# EAGLE board MotorControl_M4 (EAGLE 9.6.2), part 1 of 2
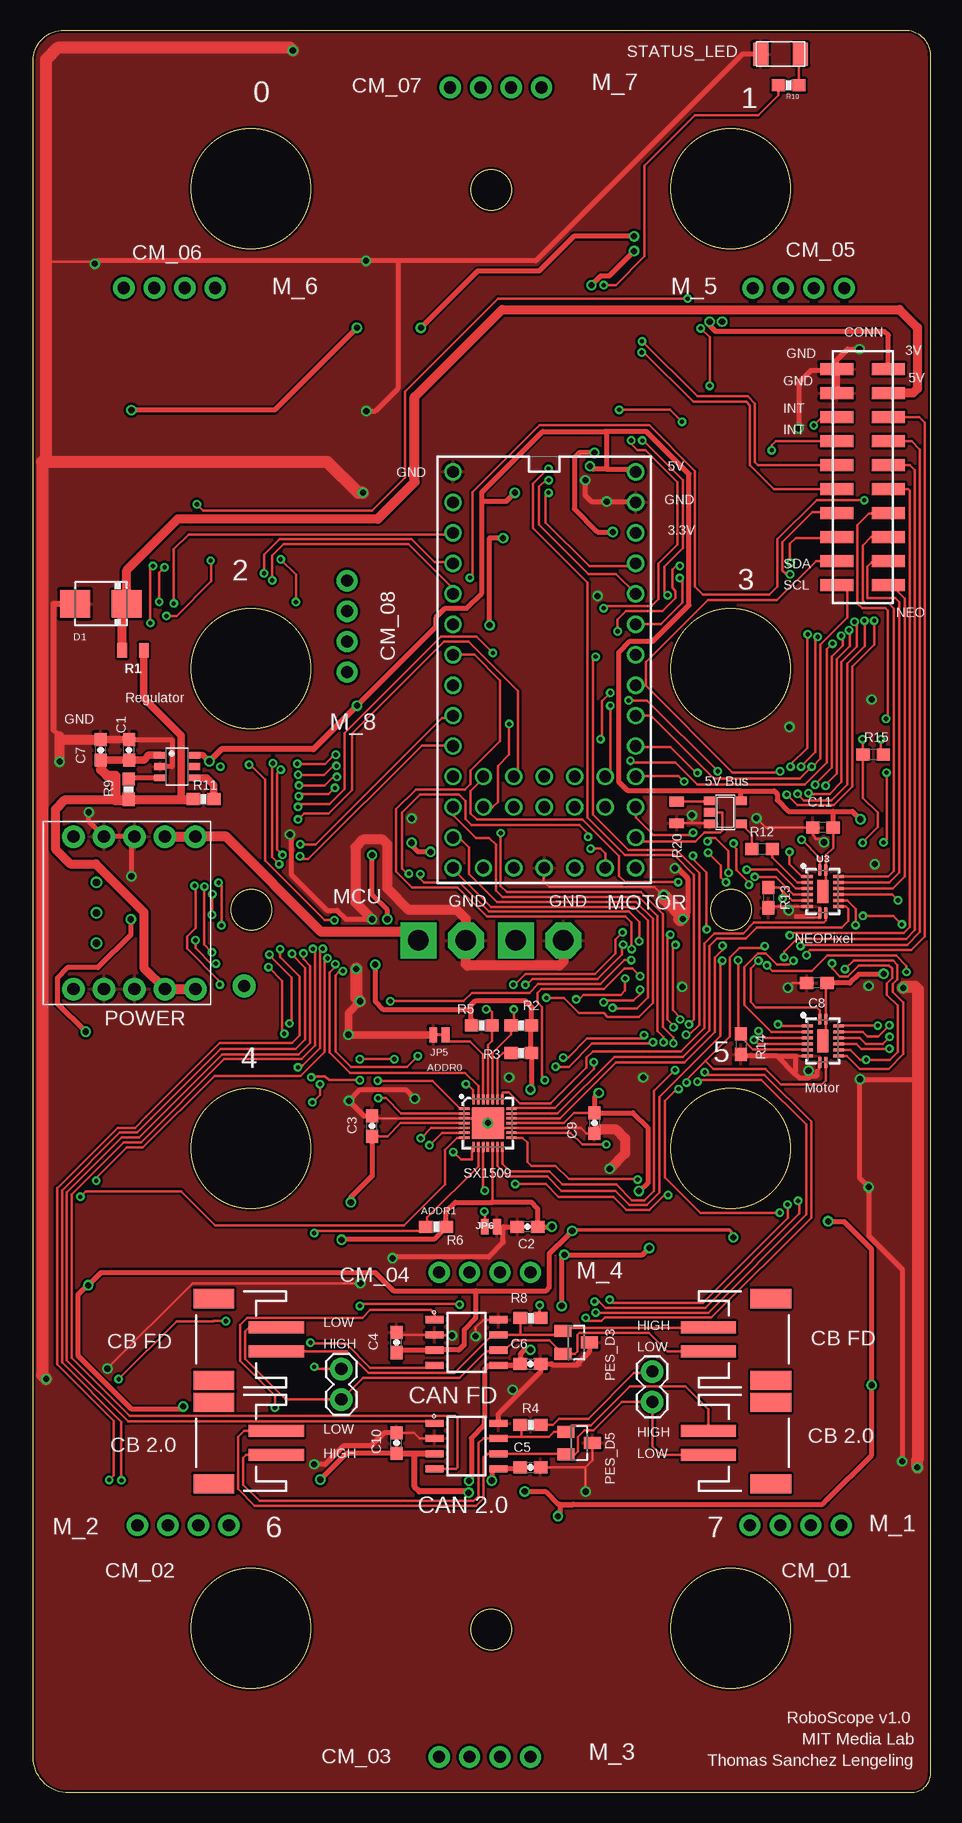
[diagram p5: board, top side]
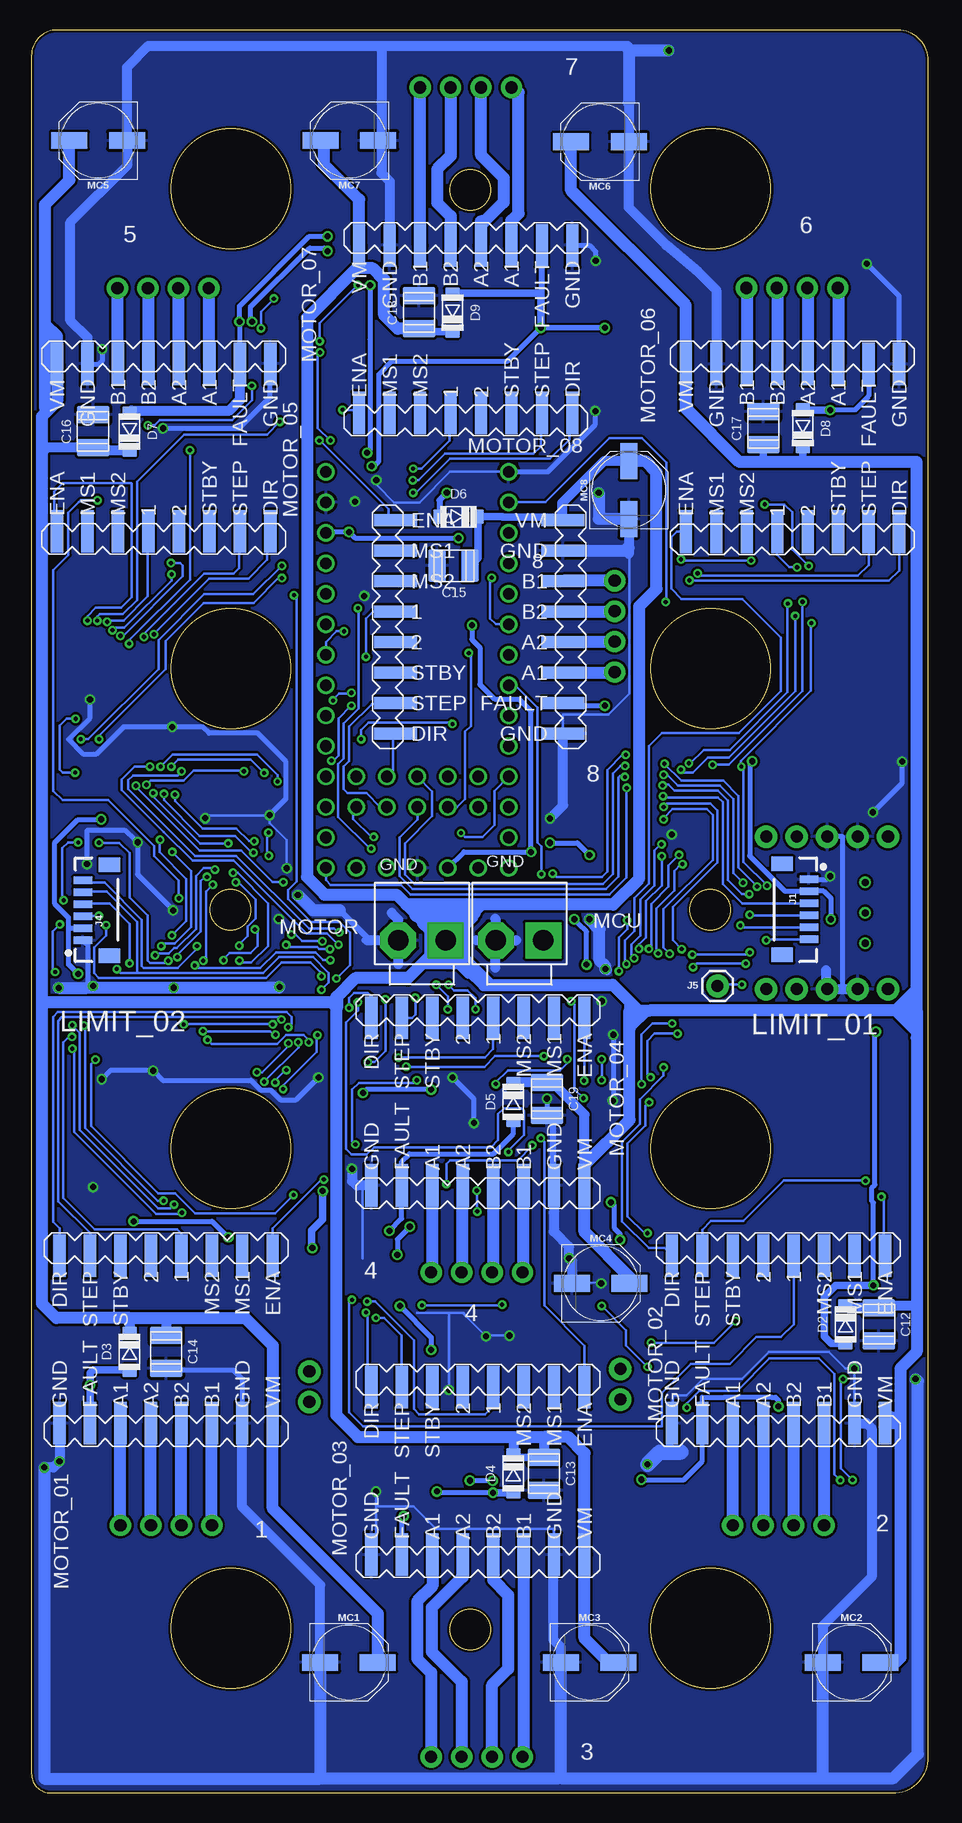
[diagram p6: board, bottom side, seen from below]

Size 74.79 x 146.95 mm. Coordinates in mm from the lower left corner, seen from the top.
Outline: 0,2.98 0,144.39 arc-90 2.56,146.95 72.66,146.95 arc-90 74.79,144.82 74.79,1.6 arc-90 73.19,0 2.98,0 arc-90 0,2.98
Outline: circle at 18.2,73.62 radius 1.7
Outline: circle at 38.2,133.62 radius 1.7
Outline: circle at 38.2,13.62 radius 1.7
Outline: circle at 58.2,73.62 radius 1.7
Outline: circle at 58.16,133.71 radius 5
Outline: circle at 58.16,93.71 radius 5
Outline: circle at 58.16,53.71 radius 5
Outline: circle at 58.16,13.71 radius 5
Outline: circle at 18.16,13.71 radius 5
Outline: circle at 18.16,53.71 radius 5
Outline: circle at 18.16,93.71 radius 5
Outline: circle at 18.16,133.71 radius 5
Copper layers (1+2*15+16): Top 0.035559375mm / dielectric 0.47751875mm / VCC 0.035559375mm / dielectric 0.47751875mm / GND 0.035559375mm / dielectric 0.47751875mm / Bottom 0.035559375mm
Design rules "SparkFun-4-Layer-General-JLCPCB": minimum track width 7mil, minimum drill 12mil, track to track 7mil, track to pad 7mil, pad to pad 7mil, via to via 7mil, smd to smd 7mil, copper to edge 7mil, drill to drill 7mil, minimum pad ring 7mil, minimum via ring 7mil, stop-mask expansion 3mil, vias tented up to drill 25mil, thermal gap 10mil
Net classes: 0 default: drill 0.35 mm, clearance 0.2 mm; 1 gnd: width 0.2 mm, drill 0.508 mm, clearance 0.2 mm; 3 vcc: width 0.2 mm, drill 0.508 mm, clearance 0.2 mm; 4 vcc5: width 0.55 mm, drill 0.508 mm, clearance 0.2 mm

## Footprints (pad centres in the part's own frame; a part is rotated, then mirrored left to right if it is on the bottom)
0603-CAP = smd 1.1 x 1: 1 -0.85,0; 2 0.85,0
0603 = smd 1.1 x 1: 1 -0.85,0; 2 0.85,0
C1210 = smd 2.7 x 1.45: 1 0,1.4; 2 0,-1.35
JST-2-SMD = smd 1 x 4.6: 1 -1,-3.7; 2 1,-3.7 | smd 1.6 x 3.4: NC1 -3.4,1.5; NC2 3.4,1.5
1X04-CLEANBIG = drill 1.016 pad 1.778: 1 -3.81,0; 2 -1.27,0; 3 1.27,0; 4 3.81,0
DO214AA = smd 2.5 x 2.3: A 2.15,0; C -2.15,0
SOD123 = smd 1.2 x 1: A 0,-1.6; C 0,1.6
SOT23-5 = smd 0.69 x 0.99: 1 -0.95,-1.29; 2 0,-1.29; 3 0.95,-1.29; 4 0.95,1.3; 5 -0.95,1.3
1X06-1MM = smd 0.6 x 1.55: 1 -2.54,1.27; 2 -1.54,1.27; 3 -0.54,1.27; 4 0.46,1.27; 5 1.46,1.27; 6 2.46,1.27 | smd 1.2 x 1.8: P$1 -3.84,-0.955; P$2 3.76,-0.955
1X02 = drill 1.016 pad 1.88: 1 0,0; 2 2.54,0
1X01 = drill 1.016 pad 1.88: 1 0,0
SMT-JUMPER_2_NC_TRACE_NO-SILK = smd 0.635 x 1.27: 1 -0.508,0; 2 0.508,0
PANASONIC_D = smd 3 x 1.4: + 2.4,0; - -2.4,0
SOIC127P600X175-8N = smd 1.5 x 0.6: 1 -2.65,1.905; 2 -2.65,0.635; 3 -2.65,-0.635; 4 -2.65,-1.905; 5 2.65,-1.905; 6 2.65,-0.635; 7 2.65,0.635; 8 2.65,1.905
DRV8880 = smd 3.556 x 1.016: 1 -6.985,1.27; 2 -6.985,-1.27; A1 6.985,-3.81; A2 6.985,-1.27; B1 6.985,3.81; B2 6.985,1.27; DIR -6.985,-8.89; ENA -6.985,8.89; FAULT 6.985,-6.35; GND_0 6.985,-8.89; GND_1 6.985,6.35; MS1 -6.985,6.35; MS2 -6.985,3.81; STBY -6.985,-3.81; STEP -6.985,-6.35; VM 6.985,8.89
87759-20 = smd 1 x 2.75: 1 -9,-2.15; 2 -9,2.15; 3 -7,-2.15; 4 -7,2.15; 5 -5,-2.15; 6 -5,2.15; 7 -3,-2.15; 8 -3,2.15; 9 -1,-2.15; 10 -1,2.15; 11 1,-2.15; 12 1,2.15; 13 3,-2.15; 14 3,2.15; 15 5,-2.15; 16 5,2.15; 17 7,-2.15; 18 7,2.15; 19 9,-2.15; 20 9,2.15
SOT23 = smd 1 x 1.4: 1 -0.95,-1.1; 2 0.95,-1.1; 3 0,1.1
B2P-VH = drill 1.7 pad 3 square: 1 -1.98,0 | drill 1.7 pad 3 octagon: 2 1.98,0
0805 = smd 0.8 x 1.2: 1 -0.9,0; 2 0.9,0
0603-RES = smd 1.1 x 1: 1 -0.85,0; 2 0.85,0
LED1206FAB = smd 1.27 x 1.905: 1 -1.651,0; 2 1.651,0
QFN-28 = smd 0.85 x 0.2: 1 -1.975,1.2; 2 -1.975,0.8; 3 -1.975,0.4; 4 -1.975,0; 5 -1.975,-0.4; 6 -1.975,-0.8; 7 -1.975,-1.2; 15 1.975,-1.2; 16 1.975,-0.8; 17 1.975,-0.4; 18 1.975,0; 19 1.975,0.4; 20 1.975,0.8; 21 1.975,1.2 | smd 0.2 x 0.85: 8 -1.2,-1.975; 9 -0.8,-1.975; 10 -0.4,-1.975; 11 0,-1.975; 12 0.4,-1.975; 13 0.8,-1.975; 14 1.2,-1.975; 22 1.2,1.975; 23 0.8,1.975; 24 0.4,1.975; 25 0,1.975; 26 -0.4,1.975; 27 -0.8,1.975; 28 -1.2,1.975 | smd 2.65 x 2.65: 29 0,0
SOT23-6 = smd 1 x 0.55: 1 -1.4,0.95; 2 -1.4,0; 3 -1.4,-0.95; 4 1.4,-0.95; 5 1.4,0; 6 1.4,0.95
DHVQFN-16-2.5X3.5MM = smd 0.9 x 0.24: 1 -1.8,-0.25; 8 1.8,-0.25; 9 1.8,0.25; 16 -1.8,0.25 | smd 0.24 x 0.9: 2 -1.25,-1.3; 3 -0.75,-1.3; 4 -0.25,-1.3; 5 0.25,-1.3; 6 0.75,-1.3; 7 1.25,-1.3; 10 1.25,1.3; 11 0.75,1.3; 12 0.25,1.3; 13 -0.25,1.3; 14 -0.75,1.3; 15 -1.25,1.3 | smd 1.9 x 0.9: EP 0,0
MOSFET_SLIDER = drill 1.016 pad 1.88: GND_1 1.27,8.89; GND_2 1.27,6.35; GND_3 13.97,8.89; GND_4 13.97,6.35; GND_5 13.97,3.81; ON 1.27,3.81; VIN_1 1.27,13.97; VIN_2 1.27,11.43; VOUT_1 13.97,13.97; VOUT_2 13.97,11.43 | drill 0.6: P$13 5.08,5.715; P$14 7.62,5.715; P$15 10.16,5.715
TEENSY_4.0_WITH_SMD_HEADER_PINS = drill 0.965: 0 -7.62,13.97; 1 -7.62,11.43; 2 -7.62,8.89; 3 -7.62,6.35; 3.3V 7.62,11.43; 3.3V1 -2.54,-16.51; 4 -7.62,3.81; 5 -7.62,1.27; 6 -7.62,-1.27; 7 -7.62,-3.81; 8 -7.62,-6.35; 9 -7.62,-8.89; 10 -7.62,-11.43; 11 -7.62,-13.97; 12 -7.62,-16.51; 13 7.62,-16.51; 14/A0 7.62,-13.97; 15/A1 7.62,-11.43; 16/A2 7.62,-8.89; 17/A3 7.62,-6.35; 18/A4 7.62,-3.81; 19/A5 7.62,-1.27; 20/A6 7.62,1.27; 21/A7 7.62,3.81; 22/A8 7.62,6.35; 23/A9 7.62,8.89; 24 5.08,-11.43; 25 5.08,-8.89; 26 2.54,-11.43; 27 2.54,-8.89; 28 0,-11.43; 29 0,-8.89; 30 -2.54,-11.43; 31 -2.54,-8.89; 32 -5.08,-11.43; 33 -5.08,-8.89; GND -7.62,16.51; GND1 0,-16.51; GND2 7.62,13.97; PGM 2.54,-16.51; RESET 5.08,-16.51; VBAT -5.08,-16.51; VIN 7.62,16.51

## Placement (x,y rotation side)
C1  47uf/10V  [0603-CAP]  7.99,86.95 90 top
C2  0.1uF  [0603-CAP]  41.21,47.2 180 top
C3  0.1uF  [0603-CAP]  28.26,55.58 90 top
C4  0.1uf  [0603-CAP]  30.29,37.55 90 top
C5  0.1uf  [0603-CAP]  41.47,27.13 0 top
C6  0.1uf  [0603-CAP]  41.47,35.77 0 top
C7  0.1uf  [0603-CAP]  5.63,86.95 90 top
C8  0.1uF  [0603]  65.34,67.52 180 top
C9  0.1uF  [0603-CAP]  46.8,55.83 270 top
C10  0.1uf  [0603-CAP]  30.29,29.16 90 top
C11  0.1uF  [0603]  65.85,80.47 180 top
C12  [C1210]  4.13,39.07 180 bottom
C13  [C1210]  32.07,26.62 180 bottom
C14  [C1210]  63.57,36.78 180 bottom
C15  [C1210]  39.56,102.29 90 bottom
C16  [C1210]  69.66,113.49 0 bottom
C17  [C1210]  13.78,113.75 0 bottom
C18  [C1210]  42.48,123.4 0 bottom
C19  [C1210]  31.82,57.87 180 bottom
CAN_INPUT  [JST-2-SMD]  16.58,37.8 90 top
CAN_INPUT1  [JST-2-SMD]  60.01,37.8 270 top
CAN_INPUT4  [JST-2-SMD]  60.01,29.16 270 top
CAN_INPUT5  [JST-2-SMD]  16.58,29.16 90 top
CM_01  1X04_STRAIGHT  [1X04-CLEANBIG]  63.57,22.31 180 top
CM_02  1X04_STRAIGHT  [1X04-CLEANBIG]  12.51,22.31 180 top
CM_03  1X04_STRAIGHT  [1X04-CLEANBIG]  37.66,3 180 top
CM_04  1X04_STRAIGHT  [1X04-CLEANBIG]  37.66,43.39 180 top
CM_05  1X04_STRAIGHT  [1X04-CLEANBIG]  63.82,125.43 0 top
CM_06  1X04_STRAIGHT  [1X04-CLEANBIG]  11.37,125.46 0 top
CM_07  1X04_STRAIGHT  [1X04-CLEANBIG]  38.58,142.17 0 top
CM_08  1X04_STRAIGHT  [1X04-CLEANBIG]  26.17,97.24 90 top
D1  S2A  [DO214AA]  5.65,99.12 180 top
D2  [SOD123]  6.92,39.07 0 bottom
D3  [SOD123]  66.61,36.78 0 bottom
D4  [SOD123]  34.61,26.62 0 bottom
D5  [SOD123]  34.61,57.61 0 bottom
D6  [SOD123]  39.18,106.38 270 bottom
D7  [SOD123]  66.61,113.49 180 bottom
D8  [SOD123]  10.48,113.75 180 bottom
D9  [SOD123]  39.69,123.4 180 bottom
DRILEGEND  [DRILEGEND]  -1.62,112.56 0 top
IC1  74AHC1G125FDBV  [SOT23-5]  57.72,81.74 270 top
J1  [1X06-1MM]  11.24,73.61 270 bottom
J2  [1X02]  25.69,35.34 270 top
J3  [1X02]  51.63,35.13 270 top
J4  [1X06-1MM]  69.23,73.61 90 bottom
J5  [1X01]  17.59,67.26 0 bottom
JP5  JUMPER-SMT_2_NC_TRACE_NO-SILK  [SMT-JUMPER_2_NC_TRACE_NO-SILK]  33.87,63.17 180 top
JP6  JUMPER-SMT_2_NC_TRACE_NO-SILK  [SMT-JUMPER_2_NC_TRACE_NO-SILK]  38.17,47.2 180 top
MC1  100uF  [PANASONIC_D]  48.33,10.88 0 bottom
MC2  100uF  [PANASONIC_D]  6.42,10.88 0 bottom
MC3  100uF  [PANASONIC_D]  28.26,10.88 0 bottom
MC4  100uF  [PANASONIC_D]  27.32,42.48 0 bottom
MC5  100uF  [PANASONIC_D]  69.23,137.74 180 bottom
MC6  100uF  [PANASONIC_D]  27.4,137.65 180 bottom
MC7  100uF  [PANASONIC_D]  48.28,137.74 180 bottom
MC8  100uF  [PANASONIC_D]  24.99,108.6 90 bottom
MCP2562_2.0  MCP2562-E/SN  [SOIC127P600X175-8N]  36.13,28.91 0 top
MCP2562FD  MCP2562-E/SN  [SOIC127P600X175-8N]  36.13,37.55 0 top
MOTOR_01  DRV8880  [DRV8880]  63.57,37.8 270 bottom
MOTOR_02  DRV8880  [DRV8880]  12.51,37.8 270 bottom
MOTOR_03  DRV8880  [DRV8880]  37.57,26.85 270 bottom
MOTOR_04  DRV8880  [DRV8880]  37.57,57.62 270 bottom
MOTOR_05  DRV8880  [DRV8880]  63.77,112.14 90 bottom
MOTOR_06  DRV8880  [DRV8880]  11.34,112.12 90 bottom
MOTOR_07  DRV8880  [DRV8880]  38.58,122.01 90 bottom
MOTOR_08  DRV8880  [DRV8880]  37.46,97.21 0 bottom
P1  M-2X10-87759  [87759-20]  69.15,109.68 90 top
PES_D3  PESD1CAN  [SOT23]  45.28,37.55 270 top
PES_D5  PESD1CAN  [SOT23]  45.53,29.16 270 top
POWER_M  B2P-VH  [B2P-VH]  42.23,71.07 180 bottom
POWER_MCU  B2P-VH  [B2P-VH]  34.1,71.07 180 bottom
R1  0.3  [0805]  8.32,95.23 0 top
R2  10K  [0603-RES]  40.71,63.96 0 top
R3  10K  [0603-RES]  40.71,61.68 0 top
R4  120  [0603-RES]  41.47,30.69 0 top
R5  10K  [0603-RES]  37.4,63.96 180 top
R6  10K  [0603-RES]  33.59,47.2 0 top
R8  120  [0603-RES]  41.47,39.58 0 top
R9  10K  [0603-RES]  7.97,83.67 90 top
R10  500  [0603-RES]  62.98,142.35 180 top
R11  10K  [0603-RES]  14.21,82.83 0 top
R12  100  [0603]  60.77,78.69 0 top
R13  10K  [0603]  61.28,74.63 270 top
R14  10k  [0603]  58.99,62.41 270 top
R15  1k  [0603]  70.04,86.57 0 top
R20  10K  [0805]  53.66,81.74 270 top
STATUS_LED  LEDFAB1206  [LED1206FAB]  62.32,144.94 180 top
SX1509  SX1509  [QFN-28]  37.91,55.83 0 top
U1  MIC2005  [SOT23-6]  12,85.55 0 top
U3  74HC4051BQ  [DHVQFN-16-2.5X3.5MM]  65.85,75.14 270 top
U4  74HC4051BQ  [DHVQFN-16-2.5X3.5MM]  65.85,62.69 270 top
U$1  MOSFET_SLIDER  [MOSFET_SLIDER]  -0.44,80.98 270 top
U$3  TEENSY_4.0_WITH_SMD_HEADER_PINS  [TEENSY_4.0_WITH_SMD_HEADER_PINS]  42.62,93.61 0 top

## Tracks (layer width: path | path; a pad name or v marks a point on that pad's centre or on a via)
3.3V  (via drill 0.51)
  Top 0.2: 38.19,49.25 38.19,49.28 38.31,49.25 | SX1509.12 38.31,49.23
  Top 0.203: C9.1 45.09,56.68 44.24,55.83 SX1509.18 | SX1509.4 30.63,55.83 29.53,54.73 C3.1 | R3.2 R2.2 41.51,64.01 41.5,64.01 | SX1509.12 38.31,49.37 38.19,49.25 | R5.2 36.55,64.44 36.53,64.47 | 40.96,26.88 40.96,27.13 C5.1 | 38.31,49.25 38.34,49.25 | 38.67,49.25 38.34,49.25 | 38.34,49.25 38.31,49.23
  Top 0.406: v56.4,122.64 56.25,122.48 56.91,121.82 70.98,121.82 71.3,121.5 P1.19 | v50.1,128.53 48.02,126.45 47.31,126.45 v46.55,125.68 | v46.8,111.71 45.53,111.71 45.13,111.31 45.13,107.04 47.06,105.11 v48.33,105.11 | 41.51,64.01 41.51,61.72 R3.2 41.56,58.72 v41.47,58.63 | R2.2 41.56,65.53 41.05,66.05 36.88,66.05 36.53,65.69 36.53,65.28 | 36.7,64.22 36.7,64.32 36.55,64.47 36.53,64.47 36.53,65.28 | 41.48,63.99 41.5,64.01 | v28.51,69.04 28.51,65.99 29.22,65.28 36.53,65.28 | v29.53,72.83 29.53,73.59 28.26,74.86 v28.26,78.19 | v33.14,78.44 32.07,78.44 31.31,79.2 v31.56,79.2 | 38.19,49.25 38.31,49.25 | 38.67,49.25 41.03,49.25 | 41.03,49.25 41.53,49.25 42.06,48.72 C2.1 v43.25,47.2 | v38.06,97.34 38.06,104.6 v39.18,104.6 | v25.72,46.11 25.77,46.16 33.4,46.16 R6.2 34.44,48.47 35.21,49.23 38.31,49.23 41,49.23 41.03,49.25 | C3.1 28.26,51.43 26.48,49.65 v26.48,49.23 | v47.16,58.35 46.8,57.99 C9.1 50.02,56.68 51.24,55.46 51.24,50.81 50.6,50.17 v50.51,50.17 | v51.37,45.42 50.82,44.86 v44.29,44.86 44.07,44.86 v44.07,40.59 | C5.1 40.49,27 MCP2562_2.0.5 38.24,27 v38.24,26.04 | v36.34,26.01 36.54,26.21 36.54,29.57 37.63,30.66 37.63,31.28 37.66,31.31 37.66,35.35 37.93,35.62 40.47,35.62 C6.1 | v41.47,36.93 40.96,36.93 40.62,36.59 C6.1 | MCP2562FD.5 40.49,35.64 C6.1
  Bottom 0.203: 51.43,45.47 v51.37,45.42
  Bottom 0.406: v50.1,128.53 50.36,128.78 51.6,128.78 56.56,123.83 56.56,122.79 v56.4,122.64 | v46.8,111.71 46.56,111.96 46.56,121.15 46.55,121.16 v46.55,125.68 | U$3.3.3V1 38.75,78.44 v33.14,78.44 33.14,90.18 34.1,91.14 36.13,91.14 37.4,92.41 37.4,95.48 38.06,96.14 v38.06,97.34 | v28.51,69.04 28.51,71.79 29.17,72.45 29.17,72.47 v29.53,72.83 | v31.56,79.2 29.28,79.2 v28.26,78.19 | v26.48,49.23 26.23,48.98 26.23,47.1 25.72,46.6 v25.72,46.11 | v41.47,58.63 46.88,58.63 v47.16,58.35 | v50.51,50.17 50.57,50.11 | v44.29,44.86 44.29,46.16 v43.25,47.2 | v39.18,104.6 47.82,104.6 v48.33,105.11 50.18,105.11 U$3.3.3V | v36.34,26.01 36.37,26.04 v38.24,26.04 | v44.07,40.59 41.47,37.98 v41.47,36.93
  Bottom 0.61: v50.51,50.17 50.51,47.81 51.43,46.89 51.43,45.47
!RESET
  Top 0.203: SX1509.23 38.71,61.21 39.18,61.68 R3.1
CAN_H
  Top 0.203: 40.58,38.18 MCP2562FD.7 38.32,38.18 35.15,35.01 27.96,35.01 26.17,36.8 CAN_INPUT.1 | R8.1 40.62,38.22 40.58,38.18 | 40.58,38.18 43.86,38.18 PES_D3.1 44.44,38.76 55.71,38.76 55.75,38.8 CAN_INPUT1.1
CAN_H2
  Top 0.203: CAN_INPUT4.1 56.31,31.96 54.38,33.89 49.75,33.89 46.5,30.64 45.67,30.64 45.65,30.62 44.94,30.62 PES_D5.1 43.43,30.11 42.99,29.67 40.71,29.67 | CAN_INPUT5.1 17.74,28.16 17.5,27.93 17.5,25.7 18.86,24.34 36.72,24.34 37.15,24.77 37.15,29.16 37.53,29.54 MCP2562_2.0.7 38.91,29.67 40.71,29.67 | R4.1 40.71,30.6 40.71,29.67
CAN_L
  Top 0.203: CAN_INPUT1.2 52.88,36.8 51.33,38.35 45.55,38.35 45.37,38.17 45.37,36.8 45.17,36.6 PES_D3.2 43.04,37.74 40.17,37.74 39.34,36.91 MCP2562FD.6 38.67,36.8 37.77,36.8 35.57,34.6 27.5,34.6 J2.2 21.05,32.8 17.67,36.17 17.67,38.47 18,38.8 CAN_INPUT.2
CAN_L2
  Top 0.2: 46.18,30.23 45.97,30.23 45.43,29.69 45.43,28.47 45.17,28.21 PES_D5.2
  Top 0.203: PES_D5.2 44.37,28.28 MCP2562_2.0.6 37.88,28.28 37.56,27.95 37.56,24.55 36.94,23.93 18.48,23.93 17.08,25.33 17.08,29.67 17.58,30.16 CAN_INPUT5.2 | 46.18,30.23 46.73,30.23 49.09,32.59 J3.2 51.63,28.91 52.37,28.16 CAN_INPUT4.2
CAN_RX2  (via drill 0.35)
  Top 0.2: 23.5,62.29 23.5,70.1 23.32,70.29 v23.32,70.35 | v11.12,98.1 11.94,98.1 14.84,101 14.84,102.68 v14.8,102.72 | v20.64,85.3 20.33,84.99 20.33,81.74
  Top 0.203: MCP2562_2.0.4 35.25,27 35.37,27.13 35.37,31.25 35.19,31.43 8.07,31.43 3.22,36.28 3.22,49.9 7.55,54.23 9,54.23 15.93,61.17 22.39,61.17 23.5,62.29 | 20.33,81.76 20.33,81.74 20.33,78.62 20.77,78.19 v20.79,78.19 | v20.64,102.82 21.91,101.55 v21.91,99.27
  Bottom 0.2: v11.12,98.1 11.12,91.84 16.64,86.31 18.39,86.31 19.65,85.05 20.39,85.05 v20.64,85.3
  Bottom 0.203: v23.32,70.35 23.11,70.56 23.11,74.12 21.68,75.55 21.68,77.3 v20.79,78.19 | U$3.0 31.95,107.58 26.61,112.92 23.91,112.92 21.86,110.88 21.86,99.32 v21.91,99.27 | v14.8,102.72 20.54,102.72 v20.64,102.82
CAN_RX3  (via drill 0.35)
  Top 0.2: 9.42,56.37 15.56,62.51 21.59,62.51 22.22,63.14 22.22,68.04 20.59,69.68 v20.59,70.34
  Top 0.203: MCP2562FD.4 33.28,35.44 28.1,35.44 26.08,37.46 23.2,37.46 v23.13,37.54 | v16.07,39.33 15.06,39.33 15.05,39.32 11.95,39.32 v7.13,34.5 | v6.34,26.09 6.72,26.47 6.72,31.01 2,35.74 2,50.25 | v22.09,82.19 22.34,82.44 24.73,82.44 25.97,83.69 25.97,88.35 34.01,96.38 36.98,96.38 v38.34,95.02 | 2,50.25 2,50.41 | 2,50.25 2,50.41 7.04,55.45 8.5,55.45 9.42,56.37
  Bottom 0.2: v20.59,70.34 21.33,71.08 21.33,73.83 17.59,77.57
  Bottom 0.203: v23.13,37.54 23.1,37.51 17.89,37.51 v16.07,39.33 | v7.13,34.5 7.3,34.32 7.3,27.06 v6.34,26.09 | U$3.30 39.32,82.18 38.64,82.87 38.64,88.48 38.17,88.95 38.17,94.85 v38.34,95.02 | 17.59,77.57 17.59,81.9 18.17,82.48 21.8,82.48 v22.09,82.19
CAN_TX2  (via drill 0.35)
  Top 0.2: 19.93,81.46 19.93,85.78 v19.98,85.83 | v11.73,99.14 11.73,103.68 12.95,104.91
  Top 0.203: MCP2562_2.0.1 33.33,30.97 7.91,30.97 2.81,36.07 2.81,50.07 7.38,54.64 8.83,54.64 15.76,61.57 22.14,61.57 23.1,62.53 23.1,68.94 22.54,69.5 v22.54,69.98 | U$3.1 34.87,104.91 12.95,104.91 | 19.93,81.46 19.93,78.01 v20.51,77.42
  Bottom 0.2: v19.98,85.83 19.92,85.77 18.73,86.95 16.57,86.95 11.75,91.77 11.75,99.11 v11.73,99.14
  Bottom 0.203: v22.54,69.98 22.69,70.13 22.69,73.72 21.2,75.21 21.2,76.87 20.64,77.42 v20.51,77.42
CAN_TX3  (via drill 0.35)
  Top 0.2: 9.82,56.21 15.62,62.01 21.87,62.01 22.68,62.81 22.68,68.78 21.58,69.88 v21.58,69.96
  Top 0.203: v22.08,81.15 22.59,81.66 24.64,81.66 26.58,83.6 26.58,88.3 34.26,95.97 36.3,95.97 40.44,91.83 40.44,85.07 U$3.31 | v7.36,26.07 7.36,30.95 2.4,35.9 2.4,50.24 7.2,55.04 8.66,55.04 9.82,56.21 | MCP2562FD.1 33.48,39.94 33.18,40.25 28.09,40.25 27.45,39.6 17.85,39.6 17.27,39.02 17.27,36 20.16,33.11 v20.16,32.11
  Bottom 0.2: 18,81.51 18,77.76 22.09,73.67 22.09,70.46 v21.58,69.96
  Bottom 0.203: v7.36,26.07 7.86,26.57 7.86,34.93 9.16,36.22 13.26,36.22 15.95,33.53 19.09,33.53 20.16,32.47 v20.16,32.11 | v22.08,81.15 22.08,81.28 21.36,82 18.48,82 18,81.51
GND_MCU  (via drill 0.51)
  Top 0.2: C4.2 30.32,38.49 30.39,38.49 | v65.94,79.24 65.69,79.5 65.27,79.5 65,79.92 C11.2 | v62.99,73.56 62.67,73.89 62.43,73.89 | v54.93,81.5 54.93,80.84 | 64.44,80.49 61.07,80.49 v60.31,81.25 | v46.07,25.12 46.07,27.12 46.04,27.13 | v62.93,67.12 63.31,67.5 64.44,67.5 C8.2 | 1.08,127.62 5.07,127.62 v5.15,127.46 | 39.19,45.99 37.84,44.64 37.66,44.64 | v34.94,38.12 33.57,38.12 MCP2562FD.2 | 52.19,75.12 51.82,75.5 43.03,75.5 42.55,75.98 42.55,77.02 U$3.GND1 | 73.47,59.49 73.77,59.49 | v64.65,60.2 64.65,59.77 64.65,59.52 | 53.76,77.08 v53.51,77.08
  Top 0.203: C9.2 46.13,54.98 45.68,55.43 SX1509.17 38.62,55.43 38.51,55.33 38.42,55.33 SX1509.29 37.4,56.34 36.9,56.34 36.79,56.23 SX1509.3 28.46,56.23 C3.2 28.44,56.37 | C5.2 46.04,27.13 46.63,27.72 PES_D5.3 | 46.38,36.78 46.38,36.61 45.53,35.77 | MCP2562_2.0.2 32.21,29.54 31.74,30.01 C10.2 | MCP2562FD.2 30.51,38.18 C4.2 | 42.32,35.11 40.39,33.19 39.17,31.97 | 27.75,56.43 27.59,56.43 | v27.29,42.47 13.29,42.47 v6.19,35.37 | MCP2562FD.8 37.53,39.45 36.9,38.82 v36.9,38.05 | R13.2 61.39,73.89 62.43,73.89 U3.7 64.55,73.38 64.3,73.13 63.54,73.13 63.54,72.96 65.6,72.96 U3.8 | R14.2 58.6,61.56 58.74,61.42 58.99,61.42 | 63.57,61.42 64.53,61.42 U4.7 | R20.2 54.93,80.84 56.38,80.84 IC1.3 | U4.8 65.5,60.79 65.5,60.3 65.34,60.15 | 64.65,59.52 63.95,59.52 63.57,59.9 63.57,60.15 | C11.2 64.46,80.47 64.44,80.49 | v52.58,74.85 52.46,74.85 52.19,75.12
  Top 0.406: v72.46,27.64 72.46,43.64 69.66,46.44 v69.66,50.5 68.94,51.22 v68.94,59.49 73.47,59.49 | C10.2 29.28,30.01 28.19,28.92 25.89,28.92 24.35,27.39 v23.43,27.39 | v5.15,127.46 5.42,127.74 27.73,127.74 v27.75,127.72 | v27.78,115.19 28.54,115.19 30.42,117.07 30.42,127.72 v27.75,127.72 | STATUS_LED.2 59.14,144.94 41.92,127.72 v27.75,127.72 | U$3.GND2 47.82,107.58 v47.82,107.65 46.55,107.65 46.04,108.16 v46.04,109.43 | v63.82,113.75 63.82,117.56 64.84,118.57 66.89,118.57 P1.20 67,119.44 67.91,120.35 v68.9,120.35 | JP6.1 39.2,47.2 | 39.2,47.2 C2.2 | v8.19,76.41 8.19,79.46 U$1.GND_1 U$1.GND_2 4.64,80.98 v4.64,81.74 | C1.2 11.57,87.8 11.57,85.55 U1.2 | C7.2 5.41,87.58 2.71,87.58 2.2,88.09 1.69,88.6 | v21.4,79.89 21.51,79.78 21.51,76.55 24.51,73.56 25.35,73.56 26.08,72.83 v28.26,72.83 | v53.51,77.08 53.74,77.08 54.58,76.23 54.58,73.36 54.24,73.03 53.95,72.74 | v54.12,67.19 54.24,67.31 | 27.59,56.43 v26.33,57.69 27.27,58.63 31.05,58.63 v31.82,57.87 | C3.2 27.75,56.43 | v29.96,44.57 30.07,44.68 37.99,44.68 39.19,45.88 39.19,45.99 39.19,46.96 39.2,46.98 39.2,47.2 | v39.99,33.59 40.39,33.19 | MCP2562_2.0.8 38.78,31.58 39.17,31.97 42.32,35.11 C6.2 43.24,35.77 43.31,35.69 45.46,35.69 | 45.53,35.77 45.46,35.69 | 45.46,35.69 45.46,35.86 46.38,36.78 PES_D3.3 | v64.65,60.2 64.65,59.63 64.58,59.56 63.9,59.56 63.57,59.9 62.04,61.42 | 62.04,61.42 58.99,61.42 | 62.04,61.42 63.57,61.42 63.57,60.15 | 64.65,59.77 65.34,59.77 65.34,60.15
  Top 0.508: 1.69,88.6 1.69,99.12 D1.A | P1.20 P1.18
  Top 0.61: C7.2 C1.2 | v27.24,65.99 26.28,65.03 v26.28,63.2 26.3,63.18 JP5.2
  Top 0.813: C9.2 47.11,55.29 48.61,55.29 49.34,54.56 49.34,53.29 v48.07,52.02 | POWER_M.2 44.21,69.3 43.88,68.96 36.21,68.96 36.08,69.09 POWER_MCU.2 36.08,72.85 35.32,73.61 31.31,73.61 29.53,75.39 29.53,79.07 29.15,79.46 27.5,79.46 26.86,78.82 26.86,74.23 v28.26,72.83 | v2.2,85.96 2.2,87.58 | 2.2,87.58 2.2,88.09 | 2.2,87.58 2.42,87.8 C7.2 | v54.17,72.85 54.14,72.85 52.58,74.41 v52.58,74.85
  Top 1.016: v1.08,34.5 0.75,34.83 0.75,110.95 1.08,110.95 | 1.08,110.95 1.08,127.62 1.08,144.48 2.1,145.5 21.4,145.5 v21.66,145.24 | v26.94,68.69 26.94,66.3 v27.24,65.99 | 53.95,72.74 53.85,72.84 | v72.53,67.11 72.61,67.19 73.52,67.19 73.77,66.94 73.77,59.49 73.77,27.87 73.73,27.82 v73.73,27.13 | v27.5,108.39 27.09,108.39 24.53,110.95 1.08,110.95 | 53.85,73.58 v52.58,74.85 54.24,73.19 54.24,73.03
  Bottom 0.2: 62.99,73.61 v62.99,73.56 | v60.31,81.25 60.11,81.45 54.98,81.45 v54.93,81.5 54.93,80.86 53.51,79.43 v53.51,77.08 | 46.07,23.87 46.07,19.87 46.44,19.87 MOTOR_03.GND_0 | 46.07,23.87 v46.07,25.12 | v62.93,67.12 62.93,67.14 | v29.96,44.57 29.98,44.57 | 42.65,39.99 39.99,39.99 | 39.99,39.99 38.78,39.99 38.61,39.77 v36.9,38.05 36.82,38.12 v34.94,38.12 | 47.19,44.54 47.19,50.24 | 24.94,104.06 24.94,91.62 26.69,89.87 30.47,89.87 MOTOR_08.GND_0 | 46.07,23.87 42.94,23.87 41.07,22 31.22,22 MOTOR_03.GND_1 | 39.99,39.99 v39.99,33.59 | v6.19,35.37 6.95,35.37 8.33,36.74 13.32,36.74 15.56,34.5 18.81,34.5 20.19,33.12 21.32,33.12 21.32,31 MOTOR_02.GND_0
  Bottom 0.203: 8.19,67.01 6.16,67.01 U$1.GND_4 | U$3.GND 39.9,110.12 42.44,107.58 44.57,107.58 46.04,109.04 v46.04,109.43 | v27.29,42.47 27.39,42.57 27.62,42.57 MC4.- | v6.19,35.37 6.19,31.12 MOTOR_02.GND_1 | v6.19,35.37 | 47.19,50.24 46.82,50.62 46.57,50.62 46.55,50.64 MOTOR_04.GND_0 | 31.82,56.85 C19.1
  Bottom 0.406: v23.43,27.39 23.18,27.39 21.4,29.16 MOTOR_02.GND_0 | 8.52,67.01 U$1.GND_3 8.19,67.01 7.18,67.01 7.18,79.71 U$1.GND_1 | MOTOR_07.GND_0 28.27,129 27.75,128.48 v27.75,127.72 | MOTOR_06.GND_0 2.45,124.77 v5.15,127.46 | MOTOR_05.GND_0 54.88,116.34 57.47,113.75 v63.82,113.75 | U$3.GND 31.73,110.12 27.78,114.08 v27.78,115.19 | v68.9,120.35 68.9,119.33 69.15,119.08 70.12,119.08 | v26.28,63.2 26.28,57.74 v26.33,57.69 | J1.1 8.45,76.15 v8.19,76.41 | J4.1 70.09,70.67 70.09,67.14 | 70.17,67.14 70.17,67.11 | v4.64,81.74 2.2,84.18 v2.2,85.96 | v70.17,77.42 70.17,80.22 66.97,80.22 66.21,79.46 66.16,79.46 v65.94,79.24 65.94,76.56 62.99,73.61 | v69.92,91.14 69.92,89.62 71.69,87.84 70.42,86.57 69.41,86.57 67.12,88.85 v63.06,88.85 60.51,88.85 59.99,88.33 55.93,88.33 53.56,85.96 53.56,82.87 v54.93,81.5 | v50.87,59.64 52.74,57.77 54.03,57.77 54.84,58.58 55.68,58.58 56.49,59.39 63.84,59.39 v64.65,60.2 68.23,60.2 v68.94,59.49 | SX1509.29 37.91,57.87 v39.69,59.64 | v31.82,57.87 31.82,56.85 | C14.1 63.44,35.26 57.98,35.26 57.22,34.5 57.22,30.43
  Bottom 0.508: 46.8,71.07 47.06,71.07 | 44.21,69.09 44.26,69.04 | 49.09,73.59 46.57,71.07 POWER_M.2
  Bottom 0.55: MC8.- 25.44,106.2 | C19.1 31.82,56.39 31.29,55.87 31.29,50.71 MOTOR_04.GND_1
  Bottom 0.813: MOTOR_02.GND_1 5.15,30.82 4.74,30.41 4.74,18 8.82,13.92 MC2.- | MC3.- 30.66,12.15 31.31,12.79 31.31,19.77 MOTOR_03.GND_1 | MC1.- 50.73,10.54 50.71,10.53 50.71,17.33 57.22,23.83 57.22,30.43 MOTOR_01.GND_1 | v29.96,44.57 29.72,44.33 MC4.- | 29.98,44.57 29.98,45.53 31.25,46.8 31.25,48.38 31.22,48.41 MOTOR_04.GND_1 | MOTOR_06.GND_1 17.69,125.28 19.18,126.76 21.86,129.01 25,132.15 MC6.- 25,140.92 25,145.54 25.08,145.62 45.62,145.62 | 70.12,119.08 MOTOR_05.GND_1 70.12,121.32 71.54,122.74 71.54,130.91 66.83,135.63 MC5.- 66.83,143.84 65.04,145.62 45.62,145.62 | 28.01,103.56 25.44,103.56 | 25.44,103.56 24.94,104.06 | MC8.- 24.99,103.27 25.27,103.56 25.44,103.56 | MC7.- 45.62,138 | 45.62,145.62 45.62,138 | 45.62,138 45.62,135.02 44.93,134.33 MOTOR_07.GND_1 | v48.07,52.02 48.07,51.01 47.68,50.62 46.57,50.62 | v26.94,68.69 26.81,68.56 | 8.52,67.01 8.52,68.56 | U$1.GND_3 6.16,67.01 | MOTOR_01.GND_0 v72.46,27.64 72.96,27.13 v73.73,27.13 | v72.53,67.11 69.81,67.11 v69.66,67.26 | v31.56,81.23 30.47,82.32 MOTOR_08.GND_0 | POWER_M.2 46.8,71.07 | POWER_M.2 44.21,69.09 | POWER_M.2 44.21,72.8 44.77,73.36 | POWER_MCU.2 36.13,71.02 36.13,68.79 | POWER_MCU.2 34.36,71.07 | POWER_MCU.2 36.08,72.8 36.13,72.85 | POWER_MCU.2 37.69,71.07
  Bottom 1.016: 24.98,103.78 25.21,103.56 28.01,103.56 MOTOR_08.GND_1 | 45.54,137.83 45.88,137.49 MC7.- | 30.8,1.22 50.61,1.22 50.73,1.34 MC1.- 50.73,1.2 73.73,1.2 v73.73,27.13 | MC3.- 30.66,1.22 8.96,1.22 | MC2.- 8.82,1.36 8.96,1.22 | 8.96,1.22 2.93,1.22 0.89,3.26 0.89,34.31 v1.08,34.5 | v21.66,145.24 25,145.24 25,140.92 | v26.94,68.69 26.94,68.92 27.42,69.41 27.42,71.99 v28.26,72.83 | v52.58,74.85 51.32,73.59 49.09,73.59 | v54.12,67.19 54.17,67.14 62.93,67.14 70.09,67.14 70.17,67.14 | v72.53,67.11 70.17,67.11 | MC8.- 27.5,106.2 v27.5,108.39
  Bottom 1.27: v23.43,27.39 22.42,28.4 20.64,28.4
  other vias: 37.91,55.83 47.06,99.78
  pour Top (isolate 0.2): -10.09,151.85 111.57,151.85 111.57,-9.95 -10.09,-9.95
  pour Bottom (isolate 0.2): -8.06,151.85 104.21,151.85 104.21,-4.87 -8.06,-4.87
INPUT_01  (via drill 0.35)
  Top 0.203: v15.56,67.39 15.56,67.65 12.82,70.39 12.82,71.37 13.56,72.11 13.56,75.52 v13.46,75.62 | v9.77,97.52 9.77,102.05 v9.99,102.27 | v13.66,107.42 14.19,106.89 28.26,106.89 31,109.63 31,116.79 38.77,124.56 v54.57,124.56 | v55.65,122.09 56.41,121.33 v56.41,117.3 | P1.16 66.92,114.76 65.85,114.76 v65.09,114
  Bottom 0.203: J5.1 16.83,67.26 16.71,67.39 v15.56,67.39 | v13.46,75.62 15.43,77.6 15.43,85.38 v15.61,85.55 15.66,85.61 15.66,86.02 9.8,91.88 9.8,97.48 v9.77,97.52 | v9.99,102.27 11.37,103.65 11.37,106.75 12.01,107.4 13.63,107.4 v13.66,107.42 | v54.57,124.56 55.65,123.49 v55.65,122.09 | v56.41,117.3 56.41,116.09 58.07,114.43 64.1,114.43 64.53,114 v65.09,114
INT_00  (via drill 0.35)
  Top 0.2: 30.75,81.74 32.24,83.23 35.51,83.23 36.05,82.7 36.05,81.2
  Top 0.203: v46.27,79.69 46.27,79.99 45.56,80.7 36.55,80.7 36.05,81.2 | v31.34,76.64 31.16,76.64 30.75,77.04 30.75,81.74 | v25.24,86.54 25.06,86.36 24.93,86.36 24.35,85.78 v22.01,85.78 | v14.9,70.06 14.24,70.72 14.24,75.5 v14.29,75.54 | v19.7,69.88 19.7,69.8 21.53,67.97 21.53,64.29 v21.38,64.14 | v23.43,46.67 23.63,46.87 32.41,46.87 R6.1 32.83,47.29 32.83,47.96 37.11,52.24 SX1509.9 | v23.29,57.56 23.92,58.2 v23.92,59.09
  Bottom 0.203: U$3.24 47.96,81.93 47.96,81.2 46.45,79.69 v46.27,79.69 | v31.34,76.64 31.03,76.33 27.23,76.33 26.77,76.79 26.77,85.28 25.52,86.54 v25.24,86.54 | v22.01,85.78 v22.01,85.77 20.62,84.38 17.12,84.38 15.84,83.1 15.84,77.12 14.29,75.57 v14.29,75.54 | v19.7,69.88 15.08,69.88 v14.9,70.06 | v21.38,64.14 23,64.14 23.92,63.23 v23.92,59.09 | v23.43,46.67 23.69,46.67 25.09,48.07 25.09,54.13 23.59,55.63 23.59,57.26 v23.29,57.56
INT_01  (via drill 0.35)
  Top 0.203: v67.38,96.45 67.5,96.32 67.5,95.64 66.59,94.72 66.59,85.46 65.21,84.08 v65.21,84.04 | v57.08,85.17 51.18,91.06 v49.65,91.06 | U$3.32 38.31,82.18 38.74,82.61 38.74,85.62 39.69,86.57 v39.69,89.11 | v63.16,102.52 63.11,102.57 63.11,104.15 63.57,104.61 66.93,104.61 P1.6 | v48.12,91.7 47.43,91 47.43,87.95 v47.31,87.84
  Bottom 0.203: v65.21,84.04 64.85,84.39 62.12,84.39 61.27,85.24 57.16,85.24 v57.08,85.17 | v47.31,87.84 47.31,88.6 46.7,89.21 40.05,89.21 39.94,89.11 v39.69,89.11 | v67.38,96.45 67.15,96.45 62.17,101.43 62.17,102.31 62.38,102.52 v63.16,102.52 | v49.65,91.06 49.65,91.14 49.14,91.65 48.17,91.65 v48.12,91.7
INT_02  (via drill 0.35)
  Top 0.203: v68.03,96.93 68.07,96.89 68.07,95.61 67,94.53 67,84.97 66.08,84.05 v66.08,83.95 | v53.79,75.93 49.37,75.93 48.85,76.45 48.85,78.09 45.8,81.13 37,81.13 36.48,81.65 36.48,83.53 37.54,84.59 U$3.33 | P1.8 66.92,106.76 64.96,106.76 62.47,104.27 62.47,101.88 62.78,101.58 v63.11,101.58
  Bottom 0.203: v68.03,96.93 67.83,97.13 67.05,97.13 63.11,101.07 v63.11,101.58 | v66.08,83.95 66.08,83.87 60.75,78.54 57.3,78.54 54.68,75.93 v53.79,75.93
INT_03  (via drill 0.35)
  Top 0.2: 55.4,84.04 64.32,84.04 66.18,85.9 66.18,95.33 v66.65,95.8 | v61.58,111.92 61.58,112.34 61.92,112.68 P1.14
  Top 0.203: 55.4,84.04 53.56,85.88 49.97,85.88 v49.8,86.05 | v48.13,90.63 48.13,85.15 U$3.25
  Bottom 0.2: v61.58,111.92 61.58,101.15 66.65,96.08 v66.65,95.8
  Bottom 0.203: v49.8,86.05 49.6,86.05 49.19,86.47 49.19,89.57 v48.13,90.63
LIMIT_01  (via drill 0.35)
  Top 0.203: v25.17,83.77 25.12,83.77 24.63,83.28 22.33,83.28 v22.14,83.09
  Bottom 0.203: J1.3 10,74.12 15.51,74.12 17.16,75.77 17.16,82.58 17.57,82.99 22.04,82.99 v22.14,83.09 | U$3.13 50.24,76.09 49.85,75.69 43.98,75.69 43.19,74.91 26.59,74.91 25.2,76.3 25.2,83.75 v25.17,83.77
LIMIT_02  (via drill 0.35)
  Top 0.203: v25.31,84.69 25.15,84.85 24.28,83.98 v22.16,83.98 | v14.94,74.92 14.91,74.9 14.91,73.22 v14.9,73.21
  Bottom 0.203: U$3.28 42.62,81.14 44.11,79.66 44.11,76.43 43.02,75.34 26.88,75.34 25.86,76.37 25.86,84.66 25.74,84.77 25.39,84.77 v25.31,84.69 | v22.16,83.98 22.06,84.08 21.68,84.08 21.17,83.57 17.57,83.57 16.73,82.73 16.73,76.1 15.55,74.92 v14.94,74.92 | v14.9,73.21 14.85,73.15 J1.4
LIMIT_03  (via drill 0.35)
  Top 0.203: v15.69,72.32 15.72,72.35 15.72,75.61 v15.46,75.88 | v25.29,85.6 25.01,85.6 24.27,84.87 v22.09,84.87
  Bottom 0.203: J1.5 15.52,72.15 v15.69,72.32 | U$3.29 41.39,83.49 41.39,81.41 43.65,79.15 43.65,76.56 42.87,75.77 27.16,75.77 26.33,76.61 26.33,84.97 25.7,85.6 v25.29,85.6 | v22.09,84.87 22.09,84.84 21.76,84.84 20.9,83.98 17.39,83.98 16.27,82.85 16.27,76.69 v15.46,75.88
MA1_01
  Bottom 1.016: CM_01.1 MOTOR_01.A1
MA1_02
  Bottom 1.016: CM_02.1 MOTOR_02.A1
MA1_03
  Bottom 1.016: CM_03.1 41.47,10.02 42.64,11.18 42.64,15.95 41.37,17.22 MOTOR_03.A1
MA1_04
  Bottom 1.016: MOTOR_04.A1 41.38,43.48 CM_04.1
MA1_05
  Bottom 1.016: MOTOR_05.A1 59.96,125.38 CM_05.1
MA1_06
  Bottom 1.016: MOTOR_06.A1 7.53,125.43 CM_06.1
MA1_07
  Bottom 1.016: MOTOR_07.A1 34.77,131.06 34.18,131.66 34.18,141.76 34.58,142.17 CM_07.1
MA1_08
  Bottom 1.016: MOTOR_08.A1 26.2,93.4 CM_08.1
MA2_01
  Bottom 1.016: CM_01.2 MOTOR_01.A2
MA2_02
  Bottom 1.016: MOTOR_02.A2 CM_02.2
MA2_03
  Bottom 1.016: MOTOR_03.A2 38.85,19.85 38.85,18.01 41.42,15.45 41.42,11.77 38.93,9.28 CM_03.2
MA2_04
  Bottom 1.016: CM_04.2 38.84,43.48 MOTOR_04.A2
MA2_05
  Bottom 1.016: CM_05.2 62.55,119.18 MOTOR_05.A2
MA2_06
  Bottom 1.016: MOTOR_06.A2 10.07,125.43 CM_06.2
MA2_07
  Bottom 1.016: MOTOR_07.A2 37.31,131 37.01,131 35.42,132.59 35.42,134.62 37.31,136.51 CM_07.2
MA2_08
  Bottom 0.55: MOTOR_08.A2 30.47,95.97
  Bottom 1.016: 30.47,95.97 CM_08.2
MB1_01
  Bottom 1.016: CM_01.4 MOTOR_01.B1
MB1_02
  Bottom 1.016: CM_02.4 MOTOR_02.B1
MB1_03
  Bottom 1.016: MOTOR_03.B1 33.76,3.09 CM_03.4
MB1_04
  Bottom 1.016: CM_04.4 33.76,43.48 MOTOR_04.B1
MB1_05
  Bottom 1.016: CM_05.4 67.63,119.18 MOTOR_05.B1
MB1_06
  Bottom 1.016: CM_06.4 15.15,125.43 MOTOR_06.B1
MB1_07
  Bottom 1.016: MOTOR_07.B1 CM_07.4
MB1_08
  Bottom 1.016: CM_08.4 30.44,101.05 MOTOR_08.B1
MB2_01
  Bottom 1.016: CM_01.3 MOTOR_01.B2
MB2_02
  Bottom 1.016: CM_02.3 MOTOR_02.B2
MB2_03
  Bottom 1.016: CM_03.3 36.39,9 35.04,10.34 35.04,16.49 36.3,17.75 MOTOR_03.B2
MB2_04
  Bottom 1.016: MOTOR_04.B2 36.3,43.48 CM_04.3
MB2_05
  Bottom 1.016: MOTOR_05.B2 65.04,125.38 CM_05.3
MB2_06
  Bottom 1.016: CM_06.3 12.61,125.43 MOTOR_06.B2
MB2_07
  Bottom 1.016: CM_07.3 39.85,136.45 40.96,135.34 40.96,132.54 39.85,131.44 MOTOR_07.B2
MB2_08
  Bottom 1.016: MOTOR_08.B2 26.2,98.48 CM_08.3
MDIR_01  (via drill 0.35)
  Top 0.203: v32.27,76.59 32.27,76.2 32.58,75.9 35.56,75.9 38,73.46 49.68,73.46 50.54,72.61 v50.54,71 | v53.13,71.54 53.13,71.44 52.9,71.22 52.9,64.47 53.39,63.97 v53.39,63.82
  Bottom 0.203: MOTOR_01.DIR 72.46,47.07 72.99,47.6 72.99,64.7 72.61,65.08 53.51,65.08 53.11,64.69 53.11,64.1 v53.39,63.82 | v32.27,76.59 32.27,78.9 32.61,79.23 32.61,90.45 34.5,92.34 U$3.6 | v53.13,71.54 52.77,71.54 52.23,71 v50.54,71
MDIR_02  (via drill 0.35)
  Top 0.2: 23.91,68.48 23.91,70.13 v24.14,70.36
  Top 0.203: U$3.8 34.95,87.31 32.41,87.31 22.93,77.83 22.44,77.83 22.24,78.03 v22.24,78.08 | v22.09,60.48 22.27,60.66 22.47,60.66 23.91,62.1 23.91,68.48
  Bottom 0.2: MOTOR_02.DIR 22.04,45.42 23.32,45.42 25.55,47.65 25.55,48.42
  Bottom 0.203: v24.14,70.36 24.14,70.72 23.55,71.3 23.55,74.33 22.24,75.65 v22.24,78.08 | 25.55,48.42 25.55,54.27 24.07,55.76 24.07,57.82 22.09,59.8 v22.09,60.48
MDIR_03  (via drill 0.35)
  Top 0.203: U$3.10 35.05,82.18 35.05,81.47 36.92,79.61 38.01,79.61 38.57,79.05 38.57,75.24 39.13,74.68 50.49,74.68 52.06,73.11 52.06,63.53 52.56,63.03 v52.56,62.58 | v55.39,59.29 55.39,59.31 55.51,59.44 60.72,59.44 64.45,55.71 64.45,48.21 56.28,40.03 v46.91,40.03 v46.9,40.04
  Bottom 0.203: MOTOR_03.DIR 46.46,34.9 46.75,35.19 46.75,39.89 v46.9,40.04 | v55.39,59.29 52.53,62.14 52.53,62.55 v52.56,62.58
MDIR_04  (via drill 0.35)
  Top 0.2: 51.25,66.3 50.36,65.41 48.33,65.41 v48.3,65.44
  Top 0.203: 51.25,66.3 51.25,72.73 50.1,73.87 38.17,73.87 35,77.03 U$3.12
  Bottom 0.2: MOTOR_04.DIR 46.46,66.39 46.75,66.68 47.89,66.68 48.3,66.27 v48.3,65.44
MDIR_05  (via drill 0.35)
  Top 0.2: U$3.17/A3 50.24,87.17 53.13,87.17 55.21,85.09 55.31,85.09 v55.39,85.02 | v64.58,96.58 64.53,96.53 64.53,87.11 63.13,85.7 v63.13,85.55
  Bottom 0.2: v55.39,85.02 56.51,86.14 62.55,86.14 v63.13,85.55 | v64.58,96.58 64.58,96.62 59.98,101.23 56.71,101.23 55.13,102.8
  Bottom 0.203: 55.13,102.8 55.13,104.9 MOTOR_05.DIR
MDIR_06  (via drill 0.35)
  Top 0.203: v19.93,101.07 19.93,103.13 20.89,104.09 31.31,104.09 35,100.4 U$3.3
  Bottom 0.203: MOTOR_06.DIR 2.45,101.91 3.32,101.05 19.9,101.05 v19.93,101.07
MDIR_07  (via drill 0.35)
  Top 0.203: U$3.23/A9 49.99,102.25 46.36,102.25 42.71,105.9 42.71,108.13 v42.97,108.39
  Bottom 0.203: v42.97,108.39 42.71,108.39 39.89,111.21 31.55,111.21 29.95,112.82 29.95,114.77 MOTOR_07.DIR
MDIR_08
  Bottom 0.203: MOTOR_08.DIR 44.66,88.32 44.66,85.23 U$3.27
MOTOR_MUX_E  (via drill 0.35)
  Top 0.203: U4.6 64.5,61.99 60.03,61.99 58.99,63.02 R14.1 58.8,63.46 58.8,69.38 v58.77,69.4 | v56.16,71.98 56.15,71.98 56.15,76.71 55.02,77.84 v55.02,78.12 | v55.03,80.05 54.82,79.84 51.72,79.84 50.24,81.31 U$3.15/A1
  Bottom 0.203: v58.77,69.4 58.67,69.51 58.67,69.61 58.27,70.01 56.53,70.01 55.93,70.6 55.93,71.75 v56.16,71.98 | v55.02,78.12 55.14,78.24 55.14,79.94 v55.03,80.05
MOTOR_MUX_RX  (via drill 0.35)
  Top 0.203: v53.91,101.28 54.12,101.07 54.12,99.22 52.32,97.42 U$3.21/A7 | U4.3 61.55,63.44 59.3,65.69 59.3,68.84 60.44,69.98 61.07,69.98 62.01,69.04 63.06,69.04 v63.39,69.37 | v69.16,79.2 69.16,79.25 70.41,80.5 70.41,81.72 69.19,82.94 R15.1 69.15,86.61 v69.15,87.84
  Bottom 0.203: v53.91,101.28 53.94,101.3 54.17,101.3 56.27,99.2 60.43,99.2 63.62,96.01 63.62,93.68 69.15,88.14 v69.15,87.84 | v63.39,69.37 63.59,69.17 64.91,69.17 65.11,69.37 65.11,73.13 66.61,74.63 66.61,78.33 67.48,79.2 v69.16,79.2
MOTOR_MUX_TX  (via drill 0.35)
  Top 0.203: v53.91,102.29 53.61,102.29 53.28,101.96 53.28,100.46 53.56,100.18 53.56,99.6 52.47,98.51 49.44,98.51 48.73,97.8 v48.73,96.83 | R15.2 70.68,86.78 v70.68,87.84
  Bottom 0.203: v70.68,87.84 70.07,87.84 64.2,93.7 64.2,96.09 60.38,99.91 56.29,99.91 v53.91,102.29 | U$3.20/A6 50.24,95.93 49.34,96.83 v48.73,96.83
MOTOR_TX_RX_01  (via drill 0.35)
  Top 0.203: v71.42,63.02 70.83,62.44 69.41,62.44 68.9,62.94 U4.13
  Bottom 0.203: v71.42,63.02 71.67,63.02 72.15,62.54 72.15,49.59 69.53,46.97 62.63,46.97 62.3,46.63 MOTOR_01.1
MOTOR_TX_RX_02  (via drill 0.35)
  Top 0.2: v62.91,49.05 62.91,47.92
  Top 0.203: U4.14 69.17,63.44 69.56,63.05 70.45,63.05 v71.39,63.99 | 62.91,47.92 55.84,40.85 48.33,40.85 v48.07,41.1
  Bottom 0.203: v71.39,63.99 70.75,63.35 70.75,55.27 64.23,48.74 63.22,48.74 v62.91,49.05 | v48.07,41.1 48.3,40.87 48.3,31.7 47.16,30.56 22.24,30.56 22.24,33.36 19.83,35.77 16.58,35.77 14.34,38 12.31,38 11.24,39.07 MOTOR_02.1
MOTOR_TX_RX_03  (via drill 0.35)
  Top 0.203: v46.8,40.97 47.19,40.97 47.72,40.44 56.03,40.44 63.9,48.31 63.9,49.22 v63.77,49.35 | v70.42,63.96 67.17,63.96 U4.15
  Bottom 0.203: v46.8,40.97 46.16,40.97 42.91,37.72 42.91,32 42.49,31.57 36.96,31.57 36.3,32.24 MOTOR_03.1 | v63.77,49.35 64.25,49.35 70.32,55.42 70.32,63.86 v70.42,63.96
MOTOR_TX_RX_04  (via drill 0.35)
  Top 0.2: 55.62,48.37 52.67,51.31
  Top 0.203: U4.12 68.65,62.44 69.06,62.03 v71.39,62.03 | 52.67,51.31 52.67,57.69 53.66,58.68 v53.81,58.68 | v50.94,63.18 50.94,62.92 50.92,62.9 46.19,62.9 44.62,61.32 44.21,61.32 v44.19,61.29 | v62.25,48.37 55.62,48.37
  Bottom 0.203: v62.25,48.37 62.25,48.27 64.38,48.27 71.21,55.1 71.21,61.85 v71.39,62.03 | v53.81,58.68 53.81,58.98 51.04,61.76 51.04,63.08 v50.94,63.18 | MOTOR_04.1 36.3,62.02 37,61.32 44.16,61.32 v44.19,61.29
MOTOR_TX_RX_05  (via drill 0.35)
  Top 0.2: 59.83,65.92 59.83,68.74 v60.47,69.37 | v59.68,75.7 59.68,75.88 58.64,76.92 58.64,78.67 58.38,78.92 v58.38,79.15 | v64.64,83.35 64.72,83.27 66.42,83.27 67.4,84.25 67.4,94.26 68.69,95.55 68.69,97.41 v68.49,97.62
  Top 0.203: U4.1 65.6,65.23 65.34,65.49 60.26,65.49 59.83,65.92
  Bottom 0.2: v60.47,69.37 60.24,69.6 60.24,75.14 v59.68,75.7 | v64.64,83.35 64.64,83.04 60.75,79.15 v58.39,79.15 v58.38,79.15 | v68.49,97.62 68.39,97.72 67.12,97.72 65.09,99.75
  Bottom 0.203: 65.09,99.75 65.09,105.11 MOTOR_05.1
MOTOR_TX_RX_06  (via drill 0.35)
  Top 0.203: v51.68,62.58 51.55,62.46 46.61,62.46 44.68,60.53 v43.55,60.53 | v32.07,61.42 31.16,60.51 26.5,60.51 25.21,61.8 25.21,68.15 25.56,68.51 v25.82,68.51 | v25.11,72.75 24.31,72.75 19.32,77.74 19.32,81.61 19.32,84.48 18.1,85.71 v18,85.71 | U4.5 60.45,62.44 v60.11,62.77 | v10.96,102.16 10.51,101.71 v10.51,99.29
  Bottom 0.203: v60.11,62.77 59.78,62.44 54.3,62.44 53.56,63.18 52.1,63.18 51.68,62.76 v51.68,62.58 | v32.07,61.42 36.13,61.42 37.02,60.53 v43.55,60.53 | v25.82,68.51 25.82,71.3 25.11,72.02 v25.11,72.75 | v18,85.71 16.64,85.71 10.51,91.84 v10.51,99.29 | v10.96,102.16 11.6,102.16 12.64,103.2 12.64,105.11 MOTOR_06.1
MOTOR_TX_RX_07  (via drill 0.35)
  Top 0.203: v62.09,64.07 62.22,63.94 U4.2 | v54.68,64.06 55.11,64.49 55.11,76.54 53.48,78.16 49.36,78.16 46.22,81.3 46.22,100.9 41.67,105.44 41.67,109.15 42.91,110.39 v42.97,110.39
  Bottom 0.203: v62.09,64.07 62.05,64.11 54.68,64.11 v54.68,64.06 | MOTOR_07.1 39.94,114.94 39.94,112.73 42.28,110.39 v42.97,110.39
MOTOR_TX_RX_08  (via drill 0.35)
  Top 0.203: U4.4 61.05,62.94 v60.49,63.51 | v54.45,63.2 54.73,63.2 55.54,64.02 55.54,76.69 53.61,78.61 49.61,78.61 46.68,81.55 46.68,94.49 v46.91,94.72
  Bottom 0.203: v54.45,63.2 54.62,63.2 54.9,63.48 60.34,63.48 60.37,63.51 v60.49,63.51 | MOTOR_08.1 46.32,98.48 46.91,97.89 v46.91,94.72
MSTEP_01  (via drill 0.35)
  Top 0.2: 30.27,82 31.92,83.65 36.01,83.65 36.45,84.09 36.45,85.22
  Top 0.203: v49.9,70.34 49.9,72.55 49.39,73.06 37.83,73.06 35.39,75.49 31.58,75.49 30.27,76.81 30.27,82 | U$3.5 36.78,94.88 38.93,92.74 38.93,87.69 36.45,85.22 | v53.56,70.69 53.33,70.46 53.33,65.26 53.94,64.65 v53.94,64.47
  Bottom 0.203: MOTOR_01.STEP 69.92,46.66 72.56,49.31 72.56,64.37 72.25,64.67 54.14,64.67 v53.94,64.47 | v53.56,70.69 53.39,70.53 50.98,70.53 50.82,70.36 49.93,70.36 v49.9,70.34
MSTEP_02  (via drill 0.35)
  Top 0.2: U$3.7 34.82,89.62 34.1,89.62
  Top 0.203: v5.26,51.02 5.26,51.27 7.8,53.81 9.15,53.81 15.12,59.78 22.31,59.78 24.32,61.78 24.32,69.38 24.52,69.58 v24.54,69.58 | v22.27,79.08 23.56,79.08 34.1,89.62
  Bottom 0.2: 18.86,46.94 18.14,47.66 15.43,47.66 12.05,51.04
  Bottom 0.203: v5.26,51.02 5.28,51.04 12.05,51.04 | v24.54,69.58 24.77,69.81 24.77,70.73 24.04,71.46 24.04,74.46 22.85,75.65 22.85,78.57 22.34,79.08 v22.27,79.08 | 18.86,46.94 MOTOR_02.STEP
MSTEP_03  (via drill 0.35)
  Top 0.203: v46.07,39.6 46.29,39.37 47.4,39.37 47.66,39.63 56.56,39.63 64.86,47.93 64.86,55.96 60.98,59.84 56,59.84 v56,60.07 | v38.98,80.02 38.98,75.59 39.49,75.09 50.66,75.09 52.49,73.26 52.49,63.86 53.38,62.97 v53.38,62.49
  Bottom 0.203: MOTOR_03.STEP 43.92,38.13 45.38,39.6 v46.07,39.6 | v38.98,80.02 38.65,79.69 37.18,79.69 36.2,80.66 36.2,83.53 U$3.9 | v56,60.07 55.54,60.07 53.38,62.23 v53.38,62.49
MSTEP_04  (via drill 0.35)
  Top 0.203: U$3.11 35.51,79.64 36.35,78.8 36.35,76.59 38.66,74.27 50.27,74.27 51.65,72.89 51.65,65.85 50.5,64.7 47.88,64.7 47.58,65 45.52,65 44.25,66.27 v42.79,66.27
  Bottom 0.203: MOTOR_04.STEP 43.05,64.61 42.79,64.87 v42.79,66.27
MSTEP_05  (via drill 0.35)
  Top 0.2: v64.02,85.55 65.22,86.75 65.22,96.17 v65.42,96.37 | U$3.16/A2 50.29,84.77 53.81,84.77 v54.27,84.31
  Bottom 0.2: v64.02,85.55 63.02,86.56 55.98,86.56 54.27,84.85 v54.27,84.31 | v65.42,96.37 65.42,96.61 60.4,101.63 57.95,101.63 57.47,102.11
  Bottom 0.203: MOTOR_05.STEP 57.47,105.11 57.47,102.11
MSTEP_06  (via drill 0.35)
  Top 0.203: U$3.2 34.92,102.58 33.48,102.58 31.56,104.5 20.54,104.5 19.25,103.22 v19.25,101.66
  Bottom 0.203: MOTOR_06.STEP 4.99,102.34 5.88,101.45 19.05,101.45 v19.25,101.66
MSTEP_07  (via drill 0.35)
  Top 0.203: U$3.22/A8 48.59,101.61 46.31,101.61 42.18,105.74 42.18,108.87 42.74,109.43 v42.99,109.43
  Bottom 0.203: MOTOR_07.STEP 32.32,114.94 32.32,112.22 32.93,111.62 40.31,111.62 42.5,109.43 v42.99,109.43
MSTEP_08
  Bottom 0.203: MOTOR_08.STEP 44.52,90.78 46.4,90.78 48.3,88.88 48.3,86.03 48.78,85.55 48.78,83.69 48.43,83.34 46.87,83.34 45.72,82.18 U$3.26
N$1  (via drill 0.35)
  Top 0.203: J2.1 23.61,35.34 v23.43,35.51 | R8.2 42.23,39.67 v42.23,40.64 | v35.55,40.7 35.47,40.77 27.42,40.77 v27.24,40.59
  Bottom 0.203: v23.43,35.51 25.21,37.29 25.21,38.56 v27.24,40.59 | v42.23,40.64 35.6,40.64 v35.55,40.7
N$3
  Top 0.203: R4.2 43.33,30.69 43.84,31.2 46.29,31.2 50.1,35.01 51.5,35.01 J3.1
N$4
  Top 0.203: U3.3 63.71,75.89 61.62,77.97 R12.2
N$10
  Top 0.61: U1.4 14.48,84.6 15.06,84.02 R11.2
N$12
  Top 0.203: R20.1 56.38,82.64 IC1.1
N$13
  Top 0.203: R9.2 8.14,84.52 8.17,84.5
  Top 0.406: 8.17,84.5 8.27,84.6 | U1.3 8.04,84.6
  Top 0.508: R9.2 8.04,84.6
N$193
  Top 0.203: R10.1 63.83,144.8 STATUS_LED.1
NEO_5V_Z
  Top 0.203: IC1.4 59.92,79.89 R12.1
NEO_MUX_E  (via drill 0.35)
  Top 0.203: U3.6 63.3,74.39 62.55,75.14 | R13.1 62.21,75.48 62.55,75.14 | v69.3,107.75 65.33,107.75 62.07,104.5 62.07,100.57 61.38,99.88 55.84,99.88 55.18,100.54 55.18,110.19 51.37,114 42.2,114 36.65,108.45 36.65,101.53 v36.42,101.3 | v62.5,74.58 | v62.5,74.58 62.5,75.09 62.55,75.14
  Bottom 0.152: v62.5,74.58 62.47,74.61
  Bottom 0.2: 70.87,107.59 70.7,107.75 v69.3,107.75
  Bottom 0.203: 70.87,107.59 71.72,106.74 71.72,103.19 72.96,101.94 72.96,83.52 72.2,82.76 68.39,82.76 64.58,78.95 64.58,78.12 62.53,76.07 62.53,74.58 v62.5,74.58 | 36.45,101.27 v36.42,101.3 36.54,101.17 36.54,97.9 36.07,97.42 U$3.4
NEO_TX3
  Top 0.203: U$3.14/A0 50.6,79.29 55.2,79.29 55.98,80.06 57.31,80.06 57.47,80.22 57.47,81.74 IC1.2
NEOPIXEL_01_5V
  Top 0.203: P1.1 71.43,100.81 72.68,99.56 72.68,76.38 71.69,75.39 U3.13
NEOPIXEL_02_5V
  Top 0.203: P1.3 70,102.68 69.56,102.24 69.56,99.6 71.87,99.6 72.22,99.25 72.22,76.71 71.4,75.89 U3.14
NEOPIXEL_03_5V
  Top 0.203: P1.5 69.84,104.68 69.15,103.99 69.15,99.38 69.36,99.17 71.34,99.17 71.77,98.74 71.77,76.87 71.29,76.39 U3.15
NEOPIXEL_04_5V  (via drill 0.35)
  Top 0.203: P1.7 71.26,106.63 69.66,106.63 68.72,105.69 68.72,99.15 69.11,98.76 71.04,98.76 71.26,98.54 71.26,89.69 v71.11,89.54 | U3.12 71.63,74.89 v72.11,74.41 | v70.91,79.23 71.16,79.48 v71.16,85.04
  Bottom 0.203: v72.11,74.41 72.21,74.51 72.21,78.76 71.74,79.23 v70.91,79.23 | v71.16,85.04 72.2,85.04 72.46,85.3 72.46,88.96 71.87,89.54 v71.11,89.54
NEOPIXEL_05_5V  (via drill 0.35)
  Top 0.203: P1.9 72.95,108.68 73.09,108.54 73.09,72.19 72.58,71.68 63.29,71.68 v63.09,71.48 | U3.1 65.6,77.93 v64.07,79.46
  Bottom 0.203: v64.07,79.46 64.12,79.41 64.12,78.41 61.89,76.18 61.89,72.67 v63.09,71.48
NEOPIXEL_06_5V  (via drill 0.35)
  Top 0.203: P1.11 73.1,110.68 73.52,110.27 73.52,71.93 72.79,71.2 63.69,71.2 62.63,70.13 v62.63,69.68 | U3.5 63.38,74.89 61.91,76.36 v60.16,76.36
  Bottom 0.203: v62.63,69.68 62.63,69.86 60.67,71.81 60.67,76 60.32,76.36 v60.16,76.36
NEOPIXEL_07_5V  (via drill 0.35)
  Top 0.203: P1.13 73.24,112.68 73.92,111.99 73.92,71.76 72.86,70.69 64.07,70.69 v63.97,70.59 | v63.06,78.44 63.06,77.42 64.09,76.39 U3.2
  Bottom 0.203: v63.97,70.59 63.74,70.82 62.86,70.82 61.48,72.19 61.48,76.86 v63.06,78.43 v63.06,78.44
NEOPIXEL_08_5V  (via drill 0.35)
  Top 0.203: P1.15 73.88,114.68 74.33,114.23 74.33,71.38 73.22,70.26 64.76,70.26 64.48,69.98 v64.48,69.83 | U3.4 63.57,75.39 61.99,76.97 v59.5,76.97
  Bottom 0.203: v59.5,76.97 59.62,77.09 60.42,77.09 61.08,76.43 61.08,72.01 62.68,70.41 62.91,70.41 63.34,69.98 64.33,69.98 v64.48,69.83
RESET  (via drill 0.35)
  Top 0.203: U$3.RESET 47.7,78.3 47.29,78.72 v46.47,78.72 | v47.56,98.76 47.73,98.92 51.54,98.92 52.14,99.52 52.14,102.46 53.71,104.04 53.71,109.28 51.05,111.93 50.39,111.93 49.86,112.47 v49.86,112.75 | v50.74,120.07 50.92,120.07 55.03,115.96 59.46,115.96 59.76,115.66 59.76,110.7 61.77,108.68 P1.10
  Bottom 0.203: v47.56,98.76 47.51,98.71 47.51,90.38 48.76,89.13 48.76,86.24 49.22,85.79 49.22,81.36 46.57,78.72 v46.47,78.72 | v49.86,112.75 49.89,112.75 50.92,113.78 50.92,119.89 v50.74,120.07
STATUS_PIN  (via drill 0.35)
  Top 0.2: v47.56,125.68 48.58,125.68 50.99,128.09 50.99,135.65
  Top 0.203: P1.12 60.43,110.68 60.16,110.95 60.16,115.83 59.58,116.41 55.36,116.41 v50.76,121.01 | 50.99,135.65 55.18,139.84 60.45,139.84 62.13,141.52 R10.2
  Bottom 0.2: v47.56,125.68 47.62,125.68 50.76,122.53 v50.76,121.01
SX00_0  (via drill 0.35)
  Top 0.203: SX1509.27 37.11,58.92 36.01,60.02 26.41,60.02 24.72,61.71 24.72,68.38 25.19,68.84 v25.19,69.09
  Bottom 0.203: v25.19,69.09 25.31,69.22 25.31,71.05 24.5,71.86 24.5,74.61 23.3,75.81 23.3,87.28 22.23,88.35 15.81,88.35 12.31,91.85 12.31,96.32 15.51,99.52 20.59,99.52 21.45,100.39 21.45,104.68 21,105.14 MOTOR_06.ENA
SX00_1  (via drill 0.35)
  Top 0.203: SX1509.28 36.69,57.83 36.69,58.58 36.18,59.09 v36.08,59.09 | v30.11,61.17 v27.24,61.17 | v27.24,59.41 24.67,59.41 24.34,59.74 23.28,59.74 v23.18,59.64 | v20.93,63.29 20.77,63.45 20.77,67.7 v19.62,68.84 | v13.53,71.07 13.53,70.43 14.93,69.02 15.12,69.02 v15.24,69.13
  Bottom 0.203: v36.08,59.09 36.08,59.21 35.05,60.24 30.71,60.24 30.11,60.84 v30.11,61.17 | v27.24,61.17 v27.24,59.41 | v23.18,59.64 23.43,59.9 23.43,62.69 22.84,63.29 v20.93,63.29 | v19.62,68.84 19.33,69.13 v15.24,69.13 | J1.6 13.45,71.15 v13.53,71.07
SX00_2  (via drill 0.35)
  Top 0.203: SX1509.1 35.65,57.03 33.32,59.37 v28.72,59.37
  Bottom 0.203: MOTOR_04.ENA 28.68,59.37 v28.72,59.37
SX00_3  (via drill 0.35)
  Top 0.2: v61.18,68.98 61.64,68.53 64.94,68.53 66.22,69.81 71.95,69.81 72.81,68.94 v72.81,68.43 | 30.69,56.63 29.4,57.92 v28.77,57.92 | v49.87,69.42 49.29,69.42 47.28,67.41 42.09,67.41 41.38,66.7 36.59,66.7 35.88,65.99 v29.78,65.99
  Top 0.203: SX1509.2 30.69,56.63 | v72.43,72.39 71.72,73.11 v69.17,73.11
  Bottom 0.2: v61.18,68.98 60.95,68.75 55.72,68.75 54.4,70.08 51.12,70.08 50.47,69.42 v49.87,69.42 | v29.78,65.99 29.5,65.72 29.5,58.65 v28.77,57.92
  Bottom 0.203: v72.81,68.43 73.02,68.63 73.02,71.81 v72.43,72.39 | v69.17,73.11 70.47,73.11 J4.3
SX00_4  (via drill 0.35)
  Top 0.203: v32.32,54.56 33.19,55.43 SX1509.5
  Bottom 0.203: MOTOR_03.ENA 28.68,37.28 32.03,40.63 32.03,54.27 v32.32,54.56
SX00_5  (via drill 0.35)
  Top 0.203: 35.92,55.02 SX1509.6 34.1,55.03 v33.04,53.98 | U4.11 68.13,61.93 68.95,61.12 v69.46,61.12 71.41,61.12 72.08,61.78 72.08,65.64 71.19,66.53 71.19,67.49 71.61,67.92 71.61,68.73 71.36,68.98 68.85,68.98 67.92,68.05 67.27,68.05 66.61,68.71 v66.61,69.14 | v52.95,49.84 52.64,49.84 51.39,48.59 49.45,48.59 48.36,49.69 43.8,49.69 42.74,50.75 v40.2,50.75
  Bottom 0.203: v66.61,69.14 66.61,69.15 66.61,72.45 68.28,74.12 70.45,74.12 J4.4 | v69.46,61.12 69.81,60.76 69.81,55.59 64.22,49.99 62.81,49.99 61.14,48.32 54.47,48.32 v52.95,49.84 | v40.2,50.75 40.2,52.43 39.89,52.74 34.23,52.74 33.04,53.92 v33.04,53.98
SX00_6  (via drill 0.35)
  Top 0.203: SX1509.7 35.91,54.61 35.34,54.61 34.33,53.6 34.33,50.73 30.93,47.32 15.18,47.32 12.36,50.14 4.38,50.14 v3.93,49.69
  Bottom 0.203: v3.93,49.69 3.75,49.51 3.75,44.91 MOTOR_02.ENA
SX00_7  (via drill 0.35)
  Top 0.203: v47.56,65.92 47.69,66.04 50.05,66.04 50.61,66.6 v50.61,66.96 | U4.10 67.84,61.44 68.92,60.36 71.34,60.36 72.56,61.58 72.56,65.89 71.69,66.76 71.69,67.42 72.07,67.79 72.07,69.03 71.7,69.4 68.41,69.4 v67.68,68.67 | SX1509.8 36.61,53.76 36.61,52.79 35.66,52.79 v35.02,53.42
  Bottom 0.152: 66.44,68.35 66.44,68.37 66.39,68.35
  Bottom 0.2: J4.5 70.44,75.13 68.53,75.13 66,72.6 66,68.35
  Bottom 0.203: v50.61,66.96 50.01,67.57 50.01,68.35 51.32,69.67 54.14,69.67 55.46,68.35 66,68.35 66.39,68.35 66.44,68.35 67.36,68.35 v67.68,68.67 | v47.56,65.92 47.56,65.23 48.56,64.24 48.56,53.68 48.1,53.22 46.84,53.22 46.24,53.82 36.49,53.82 35.88,54.44 35.88,56.6 35.41,57.07 33.93,57.07 33.71,56.85 33.71,54.85 35.02,53.54 v35.02,53.42
SX00_8  (via drill 0.35)
  Top 0.203: SX1509.13 38.71,52.58 | v57.46,69.38 57.28,69.38 57.28,63.08 52.21,58.02 52.21,50.04 51.17,49 49.73,49 48.53,50.2 44.06,50.2 42.87,51.39 39.57,51.39 38.71,52.24 38.71,52.58 | v57.98,76.71 57.98,78.51 56.89,79.6 56.25,79.6 56.1,79.45 v56.23,79.33 | v62.83,83.22 63.71,82.33 64.25,82.33 66.76,82.33 68.31,83.88 68.31,93.91 70.12,95.72 v70.12,97.72 | 38.71,52.58 38.72,52.57
  Bottom 0.203: 72.71,105.11 MOTOR_05.ENA 72.91,105.41 72.91,108.46 72.2,109.17 66.46,109.17 66.44,109.15 66.44,99.7 67.33,98.81 69.43,98.81 70.12,98.12 v70.12,97.72 | v57.46,69.38 57.28,69.2 56.48,69.2 55.07,70.61 55.07,74.16 57.62,76.71 v57.98,76.71 | v56.23,79.33 56.66,79.33 57.72,80.39 60.54,80.39 62.83,82.68 v62.83,83.22
SX00_9  (via drill 0.35)
  Top 0.203: SX1509.14 39.14,53.83 39.14,52.45 39.79,51.79 43.04,51.79 44.14,50.7 48.63,50.7 49.93,49.41 50.97,49.41 51.76,50.19 51.76,58.5 53.51,60.25 v53.53,60.25 | 56.05,61.01 58.1,63.07 58.1,68.75 58.09,68.74 58.09,69.64 58.88,70.42 60.83,70.42 v61,70.59 | 56.05,61.01 54.47,59.44 v54.47,59.21 | U4.9 66.1,59.39 65.77,59.06 62.35,59.06 61.05,60.35 56.71,60.35 56.05,61.01
  Bottom 0.2: J4.6 70.31,75.88 68.71,75.88 65.59,72.77 65.59,68.94 65.42,68.77 62.6,68.77 60.89,70.48 v61,70.59
  Bottom 0.203: v53.53,60.25 53.57,60.29 54.47,59.39 v54.47,59.21
SX00_10  (via drill 0.35)
  Top 0.203: SX1509.15 39.91,54.61 40.81,54.61 41.21,54.21 41.21,52.61 41.54,52.28 43.54,52.28 44.65,51.16 50.38,51.16 v50.41,51.13
  Bottom 0.203: v50.41,51.13 50.61,51.13 54.68,47.07 MOTOR_01.ENA
SX00_11  (via drill 0.35)
  Top 0.2: U3.11 67.87,74.39 68.57,73.69 v68.57,72.34 | v50.61,68.08 49.95,68.74 49.32,68.74 47.59,67.01 42.38,67.01 42.03,66.66 42.03,65.94 42.43,65.53 42.43,59.64 v42.66,59.41 | SX1509.16 44.81,55.03 45.79,54.06 v47.79,54.06